# EAGLE schematic Power-Conversion (EAGLE 7.5.0)
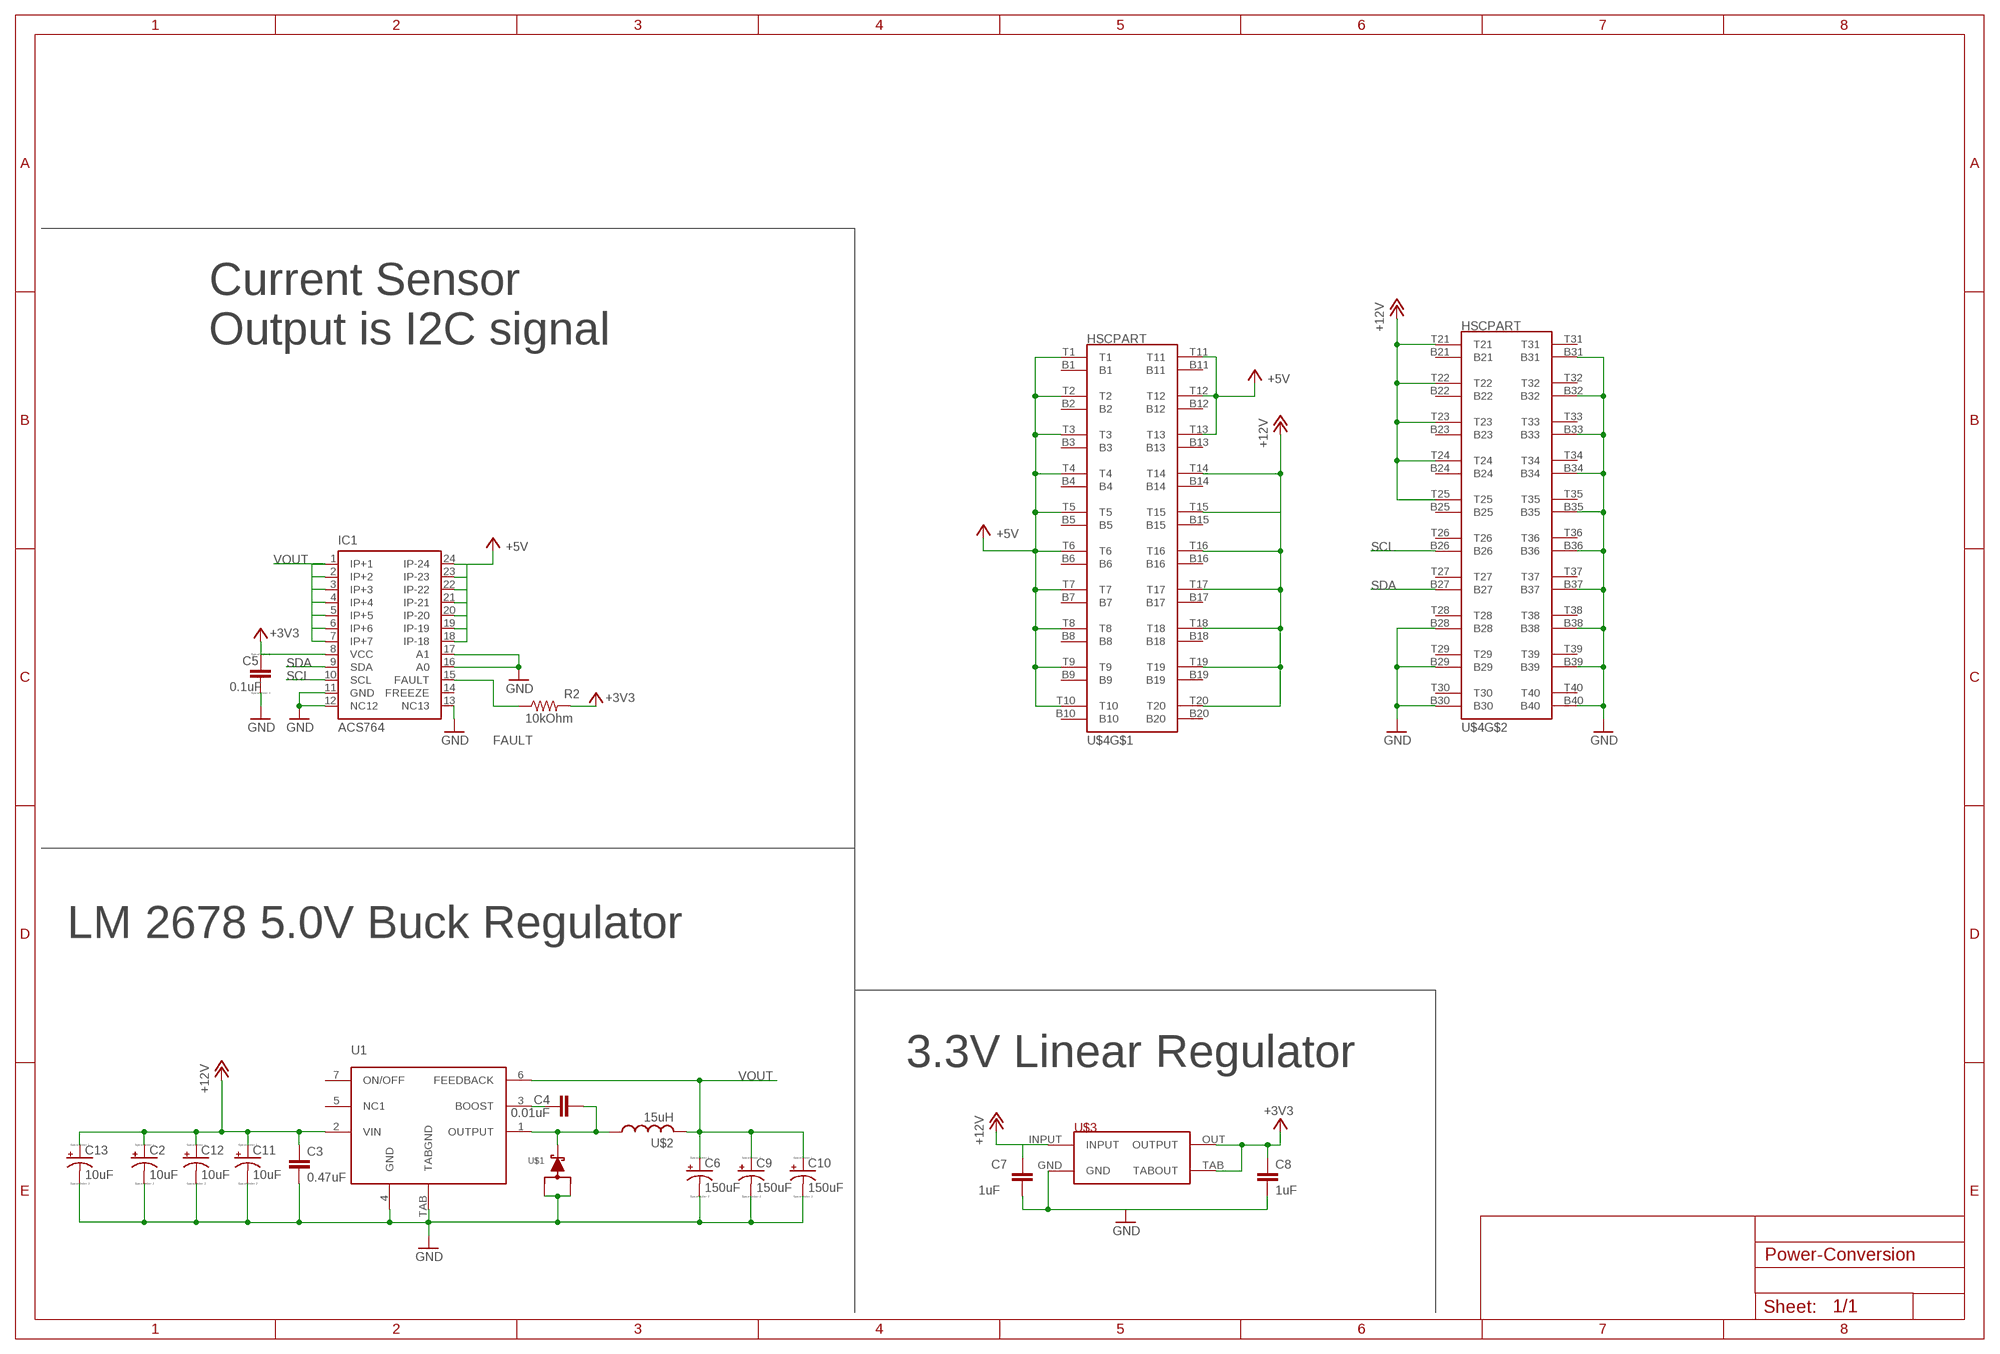
[diagram p0: schematic, sheet 1]

## Parts
C2  10uF  C-TANTALUM(10UF_150UF)  [CTAN(7.30_4.30MM)]
C3  0.47uF  CAP0805  [0805]
C4  0.01uF  CAP0603-CAP  [0603-CAP]
C5  0.1uF  CC0603  [C0603]
C6  150uF  C-TANTALUM(10UF_150UF)  [CTAN(7.30_4.30MM)]
C7  1uF  CAP0603-CAP  [0603-CAP]
C8  1uF  CAP0603-CAP  [0603-CAP]
C9  150uF  C-TANTALUM(10UF_150UF)  [CTAN(7.30_4.30MM)]
C10  150uF  C-TANTALUM(10UF_150UF)  [CTAN(7.30_4.30MM)]
C11  10uF  C-TANTALUM(10UF_150UF)  [CTAN(7.30_4.30MM)]
C12  10uF  C-TANTALUM(10UF_150UF)  [CTAN(7.30_4.30MM)]
C13  10uF  C-TANTALUM(10UF_150UF)  [CTAN(7.30_4.30MM)]
IC1  ACS764  [SSOP24]
R2  10kOhm  R-US_R0603  [R0603]
U1  LM2678  [LM2678]
U$1  SWITCHMODE_SCHOTTKY  [DPAK-3]
U$2  15uH  HCMA1305  [HCMA1305]
U$3  NCP1117  [NCP1117]
U$4  HSCPART  [HSC8-40PINOUUT]

## Nets
+3V3: C5.1 C8.1 IC1.8(VCC) R2.2 U$3.OUT(OUTPUT) U$3.TAB(TABOUT)
+5V: IC1.18(IP-18) IC1.19(IP-19) IC1.20(IP-20) IC1.21(IP-21) IC1.22(IP-22) IC1.23(IP-23) IC1.24(IP-24) U$4.T1 U$4.T2 U$4.T3 U$4.T4 U$4.T5 U$4.T6 U$4.T7 U$4.T8 U$4.T9 U$4.T10 U$4.T11 U$4.T12 U$4.T13
+12V: C2.+ C3.1 C7.1 C11.+ C12.+ C13.+ U1.2(VIN) U$3.INPUT U$4.T14 U$4.T15 U$4.T16 U$4.T17 U$4.T18 U$4.T19 U$4.T20 U$4.T21 U$4.T22 U$4.T23 U$4.T24 U$4.T25
FAULT: IC1.15(FAULT) R2.1
GND: C2.- C3.2 C5.2 C6.- C7.2 C8.2 C9.- C10.- C11.- C12.- C13.- IC1.11(GND) IC1.12(NC12) IC1.13(NC13) IC1.16(A0) IC1.17(A1) U1.4(GND) U1.TAB(TABGND) U$1.P$1 U$1.P$3 U$3.GND U$4.B28 U$4.B29 U$4.B30 U$4.B31 U$4.B32 U$4.B33 U$4.B34 U$4.B35 U$4.B36 U$4.B37 U$4.B38 U$4.B39 U$4.B40
N$2: C4.1 U1.3(BOOST)
N$3: C4.2 U1.1(OUTPUT) U$1.P$4 U$2.P$1
SCL: IC1.10(SCL) U$4.B26
SDA: IC1.9(SDA) U$4.B27
VOUT: C6.+ C9.+ C10.+ IC1.1(IP+1) IC1.2(IP+2) IC1.3(IP+3) IC1.4(IP+4) IC1.5(IP+5) IC1.6(IP+6) IC1.7(IP+7) U1.6(FEEDBACK) U$2.P$2
Unconnected: IC1.14(FREEZE) U1.5(NC1) U1.7(ON/OFF) U$4.B1 U$4.B2 U$4.B3 U$4.B4 U$4.B5 U$4.B6 U$4.B7 U$4.B8 U$4.B9 U$4.B10 U$4.B11 U$4.B12 U$4.B13 U$4.B14 U$4.B15 U$4.B16 U$4.B17 U$4.B18 U$4.B19 U$4.B20 U$4.B21 U$4.B22 U$4.B23 U$4.B24 U$4.B25 U$4.T26 U$4.T27 U$4.T28 U$4.T29 U$4.T30 U$4.T31 U$4.T32 U$4.T33 U$4.T34 U$4.T35 U$4.T36 U$4.T37 U$4.T38 U$4.T39 U$4.T40

## Notes on the sheet
- Current Sensor
  Output is I2C signal
- LM 2678 5.0V Buck Regulator
- 3.3V Linear Regulator

## Library data of the parts
C2 C6 C9-C13 = PowerComponents:C-TANTALUM(10UF_150UF)
C3 = SparkFun-Capacitors:CAP: Capacitor Standard 0603 ceramic capacitor, and 0.1" leaded capacitor.
C4 C7 C8 = SparkFun-Passives:CAP: Capacitor Standard 0603 ceramic capacitor, and 0.1" leaded capacitor.
C5 = eagle-ltspice:C: CAPACITOR, European symbol; SPICEMODEL: NONE; SPICEPREFIX: C
IC1 = ACS764:ACS764: 8-bit Microcontroller with Multiprotocol Smart Card Interface Source: Uploaded by Heiko Künzel <heiko.kuenzel@atg-gera.de> from ATG Automatisierungstechnik Gera Mon Mar 10 13:32:48 2003 Atmel-Library mit zusätzlich T83C5121-Prozessor im SSOP24-Package.; OC_FARNELL: unknown; OC_NEWARK: unknown
R2 = DiscreteComponents:R-US_: RESISTOR, American symbol
U1 = PowerComponents:LM2678: LM2678 Buck Converter IC 12V-to-5V
U$1 = PowerComponents:SWITCHMODE_SCHOTTKY: {Digi-Key Part Number: MBRD835LT4GOSCT-ND} {Voltage - DC Reverse (Vr) (Max): 35V} {Current - Average Rectified (Io): 8A} {Voltage - Forward (Vf) (Max) @ If: 510mV @ 8A} {Speed: Fast Recovery =< 500ns, > 200mA (Io)} {Current - Reverse Leakage @ Vr: 1.4mA @ 35V} {Mounting Type: Surface Mount} {Package / Case: TO-252-3, DPak (2 Leads + Tab), SC-63} {Supplier Device Package: DPAK-3} {Operating Temperature - Junction: -65°C ~ 150°C}
U$2 = DiscreteComponents:HCMA1305
U$3 = PowerComponents:NCP1117
U$4 = Connectors:HSCPART